# EAGLE schematic gloria (EAGLE 6.5.0)

## Sheet 1 of 3: Sensorenhet
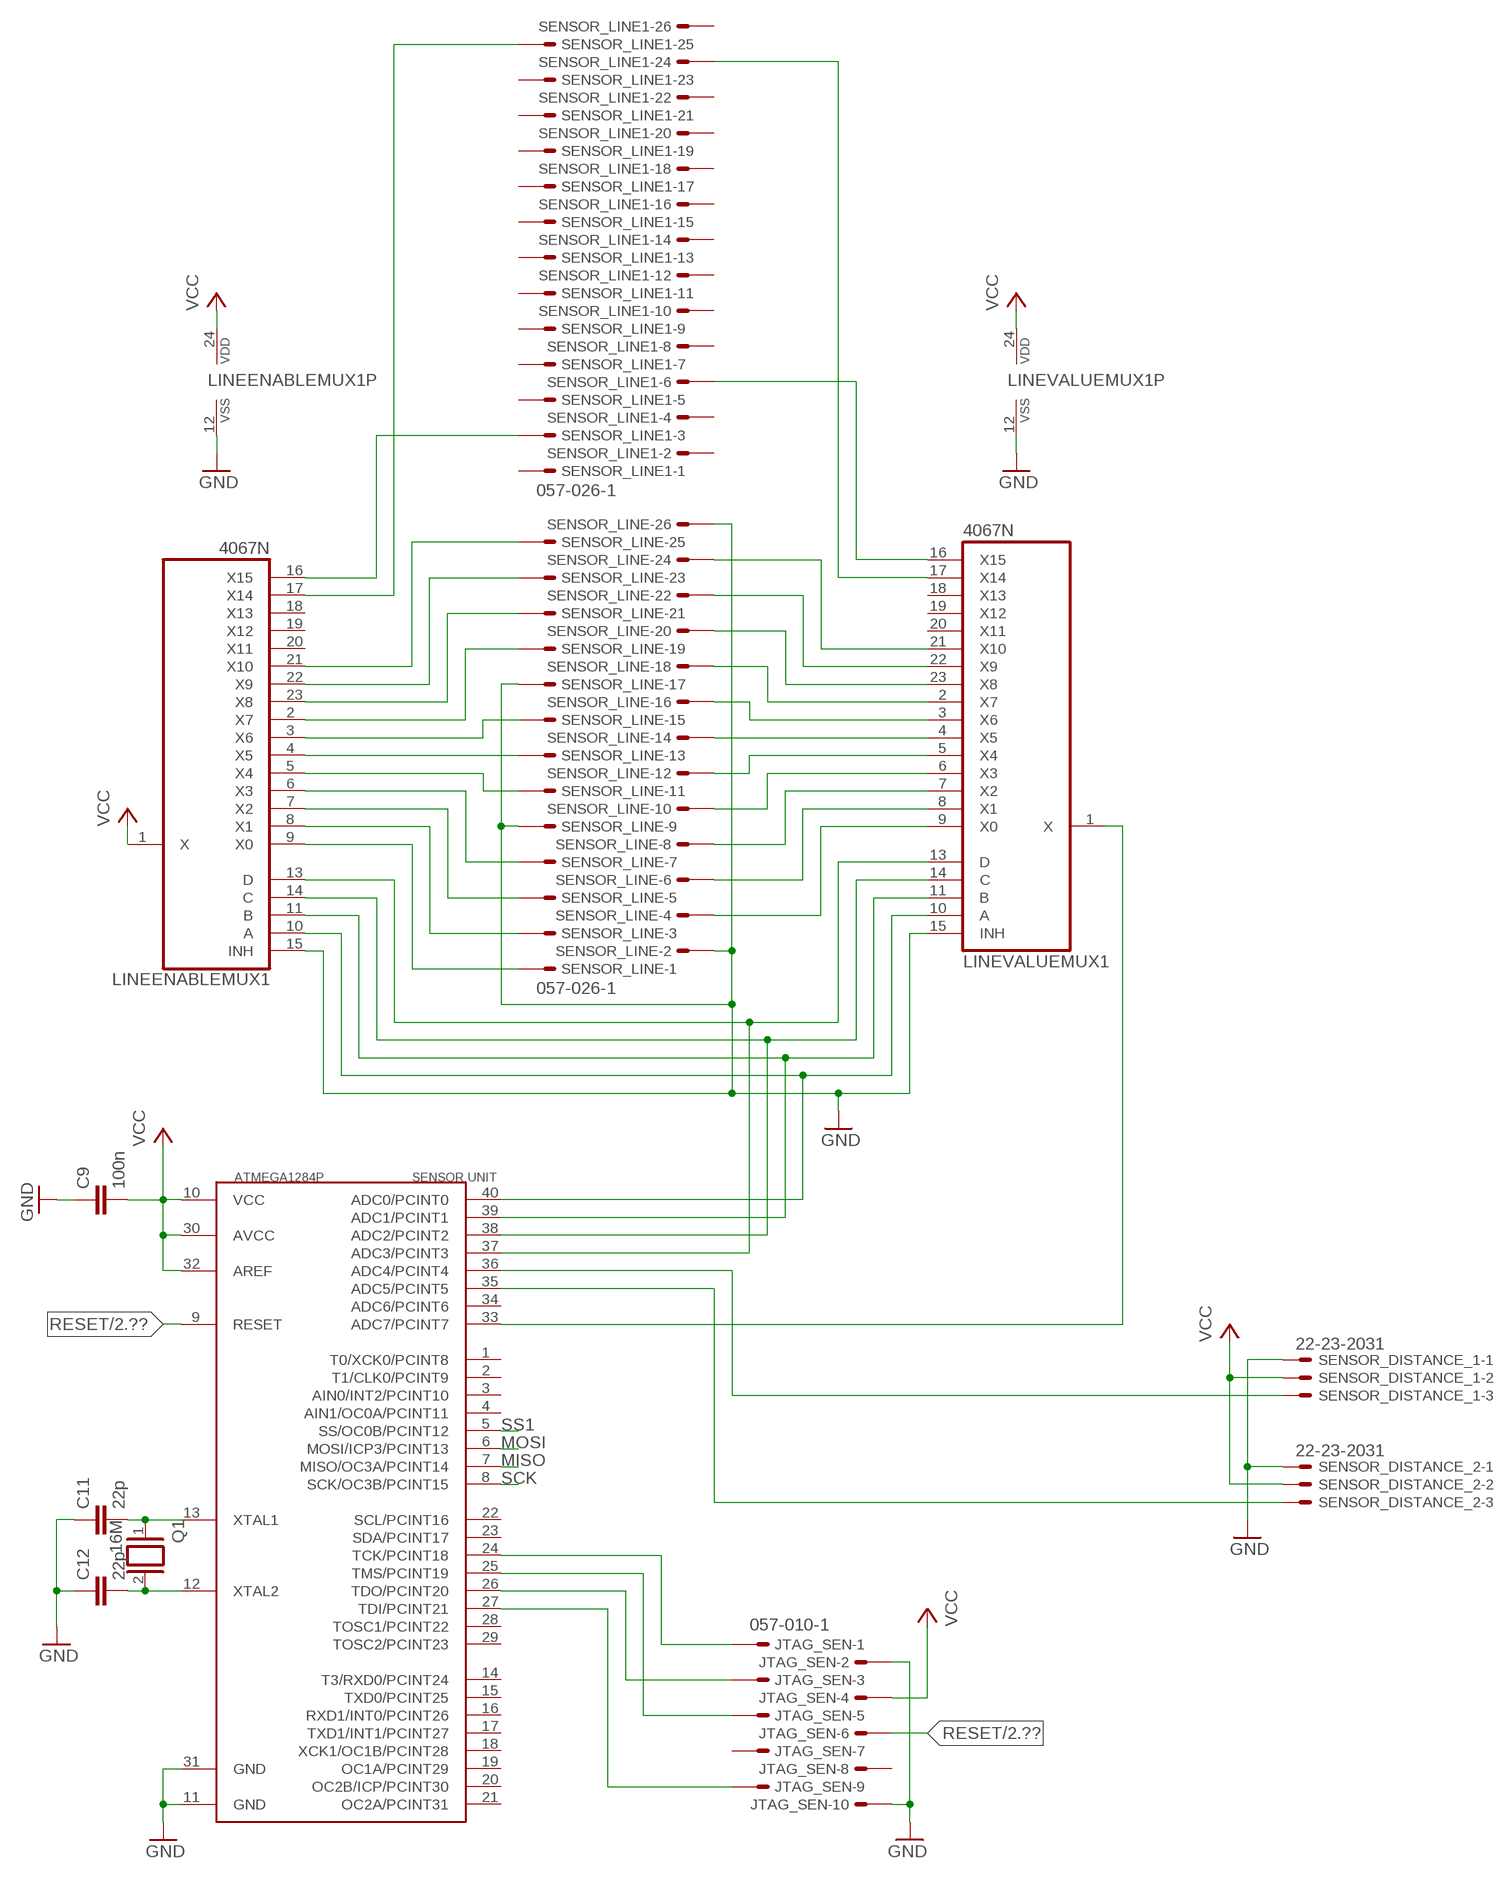
[diagram p0: schematic, sheet 1]

### Parts
ATMEGA1284P  SENSOR UNIT  MEGA1284P  [DIL40]
C9  100n  C-EU025-024X044  [C025-024X044]
C11  22p  C-EU025-024X044  [C025-024X044]
C12  22p  C-EU025-024X044  [C025-024X044]
JTAG_SEN  057-010-1  [057-010-1]
LINEENABLEMUX1  4067N  [DIL24-6]
LINEVALUEMUX1  4067N  [DIL24-6]
Q1  16M  XTAL/S  [QS]
SENSOR_DISTANCE_1  22-23-2031  [22-23-2031]
SENSOR_DISTANCE_2  22-23-2031  [22-23-2031]
SENSOR_LINE  057-026-1  [057-026-1]
SENSOR_LINE1  057-026-1  [057-026-1]

### Nets
DISTANCELEFT: ATMEGA1284P.36(ADC4/PCINT4) SENSOR_DISTANCE_1.3
GND: ATMEGA1284P.11(GND) ATMEGA1284P.31(GND) C9.1 C11.1 C12.1 JTAG_SEN.2 JTAG_SEN.10 LINEENABLEMUX1.12(VSS) LINEENABLEMUX1.15(INH) LINEVALUEMUX1.12(VSS) LINEVALUEMUX1.15(INH) SENSOR_DISTANCE_1.1 SENSOR_DISTANCE_2.1 SENSOR_LINE.2 SENSOR_LINE.9 SENSOR_LINE.17 SENSOR_LINE.26 ; also sheet 2,3
LINEADDR0: ATMEGA1284P.40(ADC0/PCINT0) LINEENABLEMUX1.10(A) LINEVALUEMUX1.10(A)
LINEADDR1: ATMEGA1284P.39(ADC1/PCINT1) LINEENABLEMUX1.11(B) LINEVALUEMUX1.11(B)
LINEADDR2: ATMEGA1284P.38(ADC2/PCINT2) LINEENABLEMUX1.14(C) LINEVALUEMUX1.14(C)
LINEADDR3: ATMEGA1284P.37(ADC3/PCINT3) LINEENABLEMUX1.13(D) LINEVALUEMUX1.13(D)
LINEVALUE: ATMEGA1284P.33(ADC7/PCINT7) LINEVALUEMUX1.1(X)
MISO: ATMEGA1284P.7(MISO/OC3A/PCINT14) ; also sheet 2,3
MOSI: ATMEGA1284P.6(MOSI/ICP3/PCINT13) ; also sheet 2,3
N$1: ATMEGA1284P.27(TDI/PCINT21) JTAG_SEN.9
N$3: ATMEGA1284P.26(TDO/PCINT20) JTAG_SEN.3
N$4: ATMEGA1284P.25(TMS/PCINT19) JTAG_SEN.5
N$5: ATMEGA1284P.24(TCK/PCINT18) JTAG_SEN.1
N$10: LINEENABLEMUX1.9(X0) SENSOR_LINE.1
N$11: LINEENABLEMUX1.8(X1) SENSOR_LINE.3
N$12: LINEENABLEMUX1.7(X2) SENSOR_LINE.5
N$13: LINEENABLEMUX1.6(X3) SENSOR_LINE.7
N$14: LINEENABLEMUX1.5(X4) SENSOR_LINE.11
N$15: LINEENABLEMUX1.4(X5) SENSOR_LINE.13
N$16: LINEENABLEMUX1.3(X6) SENSOR_LINE.15
N$17: LINEENABLEMUX1.2(X7) SENSOR_LINE.19
N$18: LINEENABLEMUX1.23(X8) SENSOR_LINE.21
N$19: LINEENABLEMUX1.22(X9) SENSOR_LINE.23
N$20: LINEENABLEMUX1.21(X10) SENSOR_LINE.25
N$21: LINEVALUEMUX1.9(X0) SENSOR_LINE.4
N$22: LINEVALUEMUX1.8(X1) SENSOR_LINE.6
N$23: LINEVALUEMUX1.7(X2) SENSOR_LINE.8
N$24: LINEVALUEMUX1.6(X3) SENSOR_LINE.10
N$25: LINEVALUEMUX1.5(X4) SENSOR_LINE.12
N$26: LINEVALUEMUX1.4(X5) SENSOR_LINE.14
N$27: LINEVALUEMUX1.3(X6) SENSOR_LINE.16
N$28: LINEVALUEMUX1.2(X7) SENSOR_LINE.18
N$29: LINEVALUEMUX1.23(X8) SENSOR_LINE.20
N$30: LINEVALUEMUX1.22(X9) SENSOR_LINE.22
N$31: LINEVALUEMUX1.21(X10) SENSOR_LINE.24
N$32: ATMEGA1284P.35(ADC5/PCINT5) SENSOR_DISTANCE_2.3
N$41: ATMEGA1284P.12(XTAL2) C12.2 Q1.2
N$43: ATMEGA1284P.13(XTAL1) C11.2 Q1.1
N$46: LINEENABLEMUX1.17(X14) SENSOR_LINE1.25
N$47: LINEVALUEMUX1.17(X14) SENSOR_LINE1.24
N$48: LINEENABLEMUX1.16(X15) SENSOR_LINE1.3
N$49: LINEVALUEMUX1.16(X15) SENSOR_LINE1.6
RESET: ATMEGA1284P.9(RESET) JTAG_SEN.6 ; also sheet 2,3
SCK: ATMEGA1284P.8(SCK/OC3B/PCINT15) ; also sheet 2,3
SS1: ATMEGA1284P.5(SS/OC0B/PCINT12) ; also sheet 3
VCC: ATMEGA1284P.10(VCC) ATMEGA1284P.30(AVCC) ATMEGA1284P.32(AREF) C9.2 JTAG_SEN.4 LINEENABLEMUX1.1(X) LINEENABLEMUX1.24(VDD) LINEVALUEMUX1.24(VDD) SENSOR_DISTANCE_1.2 SENSOR_DISTANCE_2.2 ; also sheet 2,3
Unconnected: ATMEGA1284P.1(T0/XCK0/PCINT8) ATMEGA1284P.2(T1/CLK0/PCINT9) ATMEGA1284P.3(AIN0/INT2/PCINT10) ATMEGA1284P.4(AIN1/OC0A/PCINT11) ATMEGA1284P.14(T3/RXD0/PCINT24) ATMEGA1284P.15(TXD0/PCINT25) ATMEGA1284P.16(RXD1/INT0/PCINT26) ATMEGA1284P.17(TXD1/INT1/PCINT27) ATMEGA1284P.18(XCK1/OC1B/PCINT28) ATMEGA1284P.19(OC1A/PCINT29) ATMEGA1284P.20(OC2B/ICP/PCINT30) ATMEGA1284P.21(OC2A/PCINT31) ATMEGA1284P.22(SCL/PCINT16) ATMEGA1284P.23(SDA/PCINT17) ATMEGA1284P.28(TOSC1/PCINT22) ATMEGA1284P.29(TOSC2/PCINT23) ATMEGA1284P.34(ADC6/PCINT6) JTAG_SEN.7 JTAG_SEN.8 LINEENABLEMUX1.18(X13) LINEENABLEMUX1.19(X12) LINEENABLEMUX1.20(X11) LINEVALUEMUX1.18(X13) LINEVALUEMUX1.19(X12) LINEVALUEMUX1.20(X11) SENSOR_LINE1.1 SENSOR_LINE1.2 SENSOR_LINE1.4 SENSOR_LINE1.5 SENSOR_LINE1.7 SENSOR_LINE1.8 SENSOR_LINE1.9 SENSOR_LINE1.10 SENSOR_LINE1.11 SENSOR_LINE1.12 SENSOR_LINE1.13 SENSOR_LINE1.14 SENSOR_LINE1.15 SENSOR_LINE1.16 SENSOR_LINE1.17 SENSOR_LINE1.18 SENSOR_LINE1.19 SENSOR_LINE1.20 SENSOR_LINE1.21 SENSOR_LINE1.22 SENSOR_LINE1.23 SENSOR_LINE1.26

## Sheet 2 of 3: Styrenhet
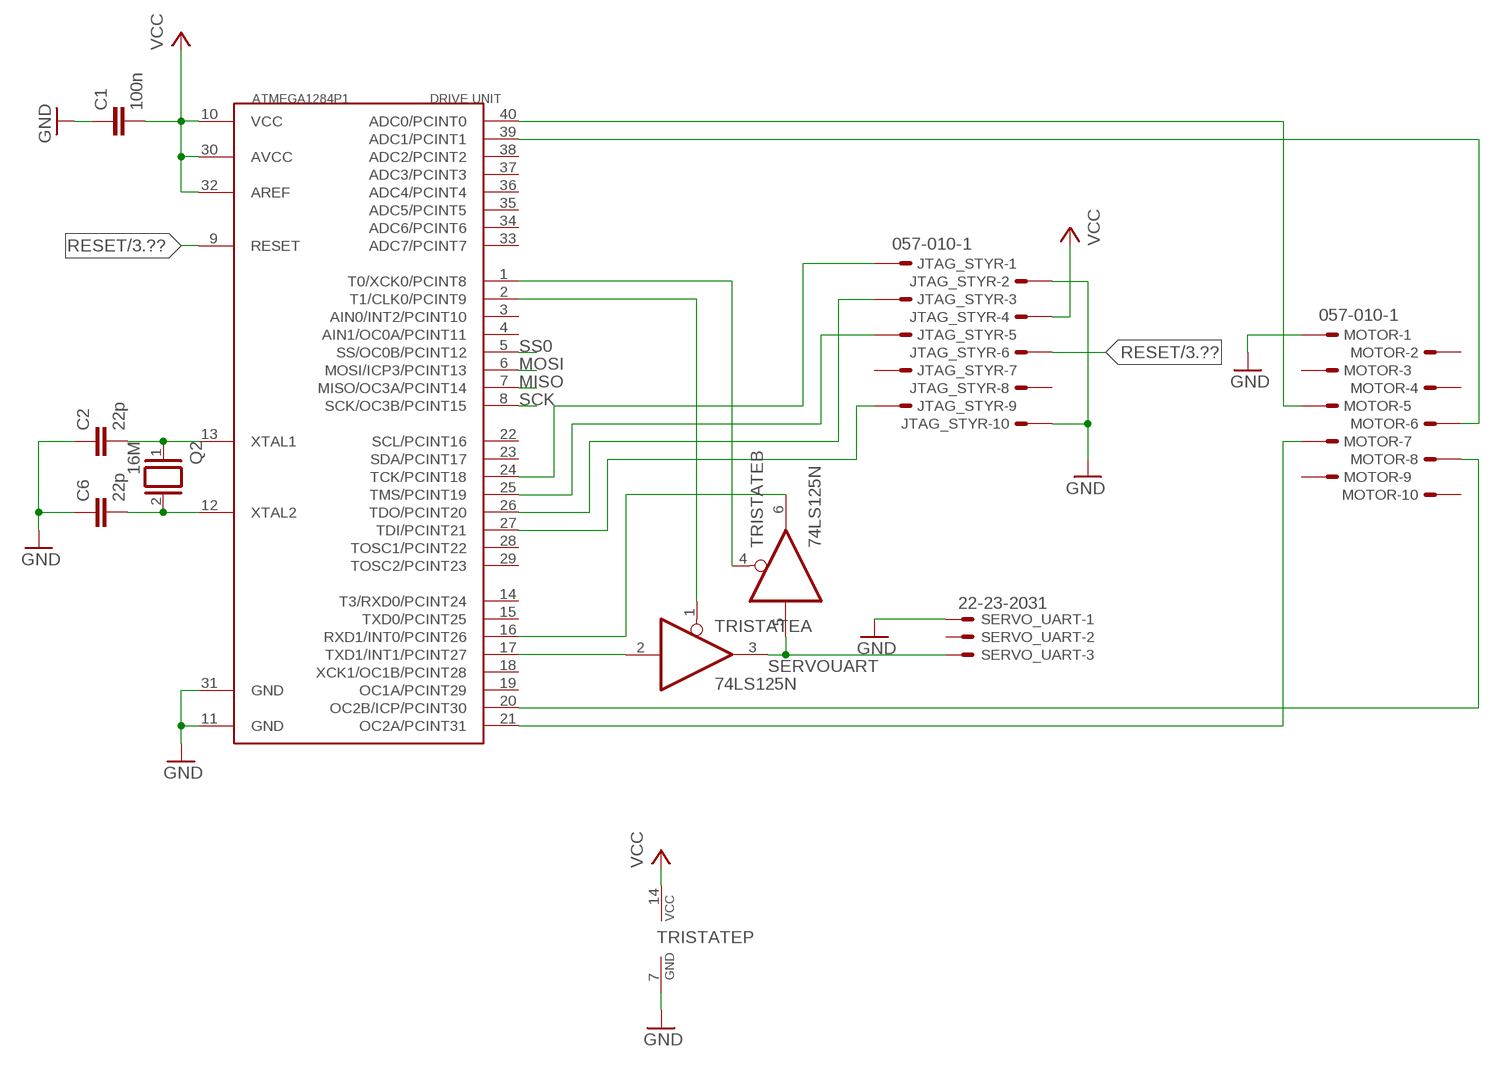
[diagram p1: schematic, sheet 2]

### Parts
ATMEGA1284P1  DRIVE UNIT  MEGA1284P  [DIL40]
C1  100n  C-EU025-024X044  [C025-024X044]
C2  22p  C-EU025-024X044  [C025-024X044]
C6  22p  C-EU025-024X044  [C025-024X044]
JTAG_STYR  057-010-1  [057-010-1]
MOTOR  057-010-1  [057-010-1]
Q2  16M  XTAL/S  [QS]
SERVO_UART  22-23-2031  [22-23-2031]
TRISTATE  74LS125N  [DIL14]

### Nets
GND: ATMEGA1284P1.11(GND) ATMEGA1284P1.31(GND) C1.1 C2.1 C6.1 JTAG_STYR.2 JTAG_STYR.10 MOTOR.1 SERVO_UART.1 TRISTATE.7(P:GND) ; also sheet 1,3
MISO: ATMEGA1284P1.7(MISO/OC3A/PCINT14) ; also sheet 1,3
MOSI: ATMEGA1284P1.6(MOSI/ICP3/PCINT13) ; also sheet 1,3
N$2: ATMEGA1284P1.24(TCK/PCINT18) JTAG_STYR.1
N$6: ATMEGA1284P1.27(TDI/PCINT21) JTAG_STYR.9
N$7: ATMEGA1284P1.26(TDO/PCINT20) JTAG_STYR.3
N$8: ATMEGA1284P1.25(TMS/PCINT19) JTAG_STYR.5
N$9: ATMEGA1284P1.21(OC2A/PCINT31) MOTOR.7
N$34: ATMEGA1284P1.40(ADC0/PCINT0) MOTOR.5
N$40: ATMEGA1284P1.39(ADC1/PCINT1) MOTOR.6
N$42: ATMEGA1284P1.20(OC2B/ICP/PCINT30) MOTOR.8
N$44: ATMEGA1284P1.12(XTAL2) C6.2 Q2.2
N$45: ATMEGA1284P1.13(XTAL1) C2.2 Q2.1
RESET: ATMEGA1284P1.9(RESET) JTAG_STYR.6 ; also sheet 1,3
SCK: ATMEGA1284P1.8(SCK/OC3B/PCINT15) ; also sheet 1,3
SERVOUART: SERVO_UART.3 TRISTATE.3(A:O) TRISTATE.5(B:I)
SS0: ATMEGA1284P1.5(SS/OC0B/PCINT12) ; also sheet 3
STYR_UART_RX_E: ATMEGA1284P1.1(T0/XCK0/PCINT8) TRISTATE.4(B:OE)
STYR_UART_TX_E: ATMEGA1284P1.2(T1/CLK0/PCINT9) TRISTATE.1(A:OE)
UART1RX: ATMEGA1284P1.16(RXD1/INT0/PCINT26) TRISTATE.6(B:O)
UART1TX: ATMEGA1284P1.17(TXD1/INT1/PCINT27) TRISTATE.2(A:I)
VCC: ATMEGA1284P1.10(VCC) ATMEGA1284P1.30(AVCC) ATMEGA1284P1.32(AREF) C1.2 JTAG_STYR.4 TRISTATE.14(P:VCC) ; also sheet 1,3
Unconnected: ATMEGA1284P1.3(AIN0/INT2/PCINT10) ATMEGA1284P1.4(AIN1/OC0A/PCINT11) ATMEGA1284P1.14(T3/RXD0/PCINT24) ATMEGA1284P1.15(TXD0/PCINT25) ATMEGA1284P1.18(XCK1/OC1B/PCINT28) ATMEGA1284P1.19(OC1A/PCINT29) ATMEGA1284P1.22(SCL/PCINT16) ATMEGA1284P1.23(SDA/PCINT17) ATMEGA1284P1.28(TOSC1/PCINT22) ATMEGA1284P1.29(TOSC2/PCINT23) ATMEGA1284P1.33(ADC7/PCINT7) ATMEGA1284P1.34(ADC6/PCINT6) ATMEGA1284P1.35(ADC5/PCINT5) ATMEGA1284P1.36(ADC4/PCINT4) ATMEGA1284P1.37(ADC3/PCINT3) ATMEGA1284P1.38(ADC2/PCINT2) JTAG_STYR.7 JTAG_STYR.8 MOTOR.2 MOTOR.3 MOTOR.4 MOTOR.9 MOTOR.10 SERVO_UART.2 TRISTATE.8(C:O) TRISTATE.9(C:I) TRISTATE.10(C:OE) TRISTATE.11(D:O) TRISTATE.12(D:I) TRISTATE.13(D:OE)

## Sheet 3 of 3: Allmänt
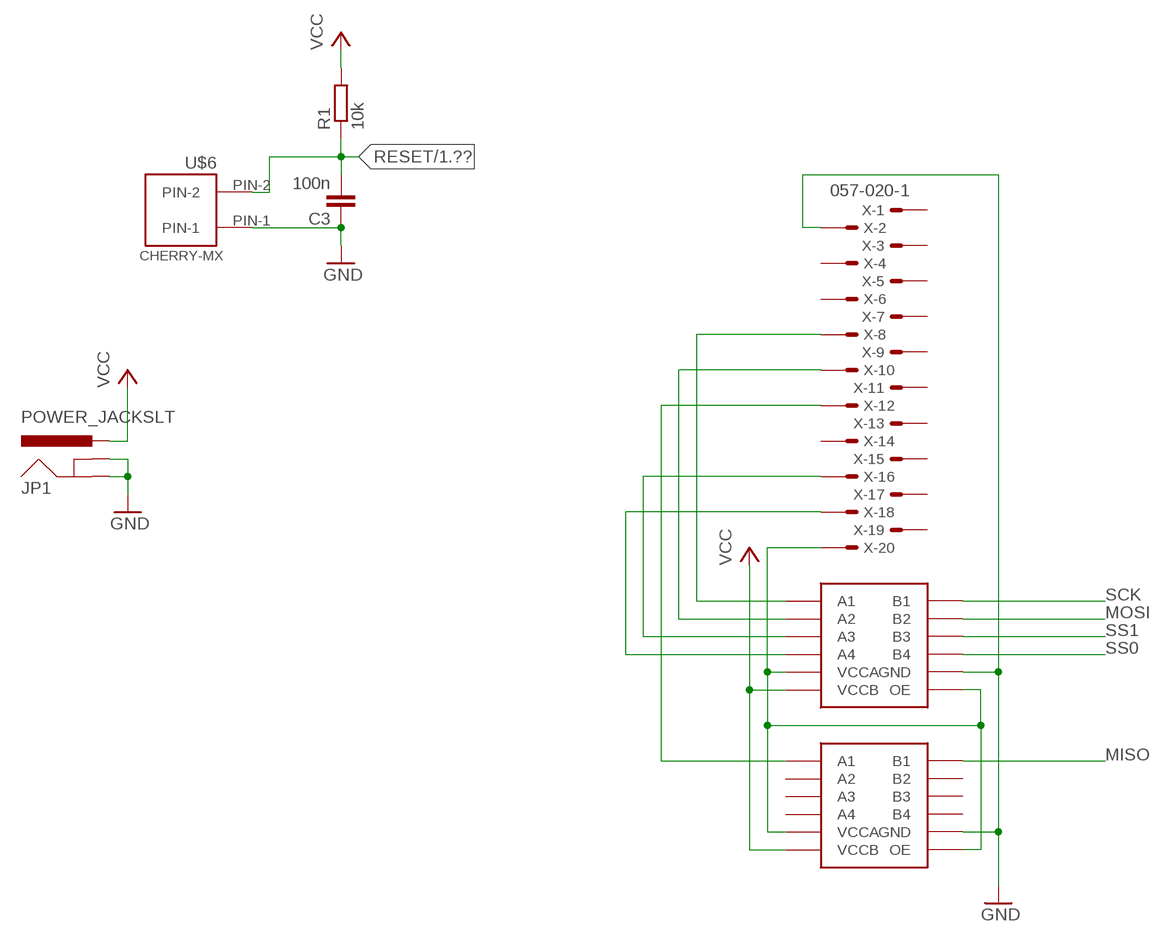
[diagram p2: schematic, sheet 3]

### Parts
C3  100n  C-EU025-024X044  [C025-024X044]
JP1  POWER_JACKSLT  [POWER_JACK_SLOT]
R1  10k  R-EU_0204/2V  [0204V]
U$1  TXB0104SOIC(D)  [TXB0104]
U$2  TXB0104SOIC(D)  [TXB0104]
U$6  CHERRY-MX-I  [CHERRY-MX-I]
X  057-020-1  [057-020-1]

### Nets
GND: C3.1 JP1.GND@1(GNDBREAK) JP1.GND@2(GND) U$1.P$7(GND) U$2.P$7(GND) U$6.PIN-1 X.2 ; also sheet 1,2
MISO: U$2.P$13(B1) ; also sheet 1,2
MOSI: U$1.P$12(B2) ; also sheet 1,2
N$33: U$1.P$1(VCCA) U$1.P$8(OE) U$2.P$1(VCCA) U$2.P$8(OE) X.20
N$35: U$1.P$2(A1) X.8
N$36: U$1.P$3(A2) X.10
N$37: U$2.P$2(A1) X.12
N$38: U$1.P$4(A3) X.16
N$39: U$1.P$5(A4) X.18
RESET: C3.2 R1.1 U$6.PIN-2 ; also sheet 1,2
SCK: U$1.P$13(B1) ; also sheet 1,2
SS0: U$1.P$10(B4) ; also sheet 2
SS1: U$1.P$11(B3) ; also sheet 1
VCC: JP1.PWR R1.2 U$1.P$14(VCCB) U$2.P$14(VCCB) ; also sheet 1,2
Unconnected: U$2.P$3(A2) U$2.P$4(A3) U$2.P$5(A4) U$2.P$10(B4) U$2.P$11(B3) U$2.P$12(B2) X.1 X.3 X.4 X.5 X.6 X.7 X.9 X.11 X.13 X.14 X.15 X.17 X.19

## Library data of the parts
ATMEGA1284P ATMEGA1284P1 = 1284p:MEGA1284P: Atmel ATmega1284P 8-bit AVR Microcontroller
C1-C3 C6 C9 C11 C12 = rcl:C-EU: CAPACITOR, European symbol
JP1 = SparkFun-Connectors:POWER_JACK: Power Jack This is the standard 5.5mm barrel jack for power. The PTH is the most common, proven, reliable, footprint. The Slot footprint only works if the mill layer is transmitted to the PCB fab house so be warned. Mating wall wart : TOL-00298 (and others); PROD_ID: PRT-00119
JTAG_SEN JTAG_STYR MOTOR = con-panduit:057-010-: CONNECTOR 10-pin series 057 contact pc board low profile headers; OC_FARNELL: unknown; OC_NEWARK: unknown
LINEENABLEMUX1 LINEVALUEMUX1 = 40xx:4067: 16-channel ANALOG MULTIPLEXER
Q1 Q2 = special:XTAL/S: CRYSTAL
R1 = rcl:R-EU_: RESISTOR, European symbol
SENSOR_DISTANCE_1 SENSOR_DISTANCE_2 SERVO_UART = con-molex:22-23-2031: .100" (2.54mm) Center Header - 3 Pin; MF: MOLEX; MPN: 22-23-2031; OC_FARNELL: 1462950; OC_NEWARK: 30C0862
SENSOR_LINE SENSOR_LINE1 = con-panduit:057-026-: CONNECTOR 20-pin series 057 contact pc board low profile headers; OC_FARNELL: unknown; OC_NEWARK: unknown
TRISTATE = 74xx-eu:74*125: Quad bus BUFFER, 3-state
U$1 U$2 = 3DRobotics_Master_Library:TXB0104: TI TXB0104 4-Bit Bidirectional Voltage-Level Translator with Auto Direction Sensing This 4-bit noninverting translator uses two separate configurable power-supply rails. The A port is designed to track VCCA. VCCA accepts any supply voltage from 1.2 V to 3.6 V. The B port is designed to track VCCB. VCCB accepts any supply voltage from 1.65 V to 5.5 V. This allows for universal low-voltage bidirectional translation between any of the 1.2-V, 1.5-V, 1.8-V, 2.5-V, 3.3-V, and 5-V voltage nodes. VCCA should not exceed VCCB.; DATASHEET: http://focus.ti.com/lit/ds/symlink/txb0104.pdf; LINK: http://search.digikey.com/scripts/DkSearch/dksus.dll?Detail&name=296-21928-1-ND; MFGPN: TXB0104DR; PN: 296-21928-1-ND
U$6 = cherrymx:CHERRY-MX-I
X = con-panduit:057-020-: CONNECTOR 20-pin series 057 contact pc board low profile headers; OC_FARNELL: unknown; OC_NEWARK: unknown

## Net classes
0 signal: width 0.254 mm, clearance 0.254 mm
1 vcc: width 0.508 mm, clearance 0.254 mm